# EAGLE design board (EAGLE 6.4)
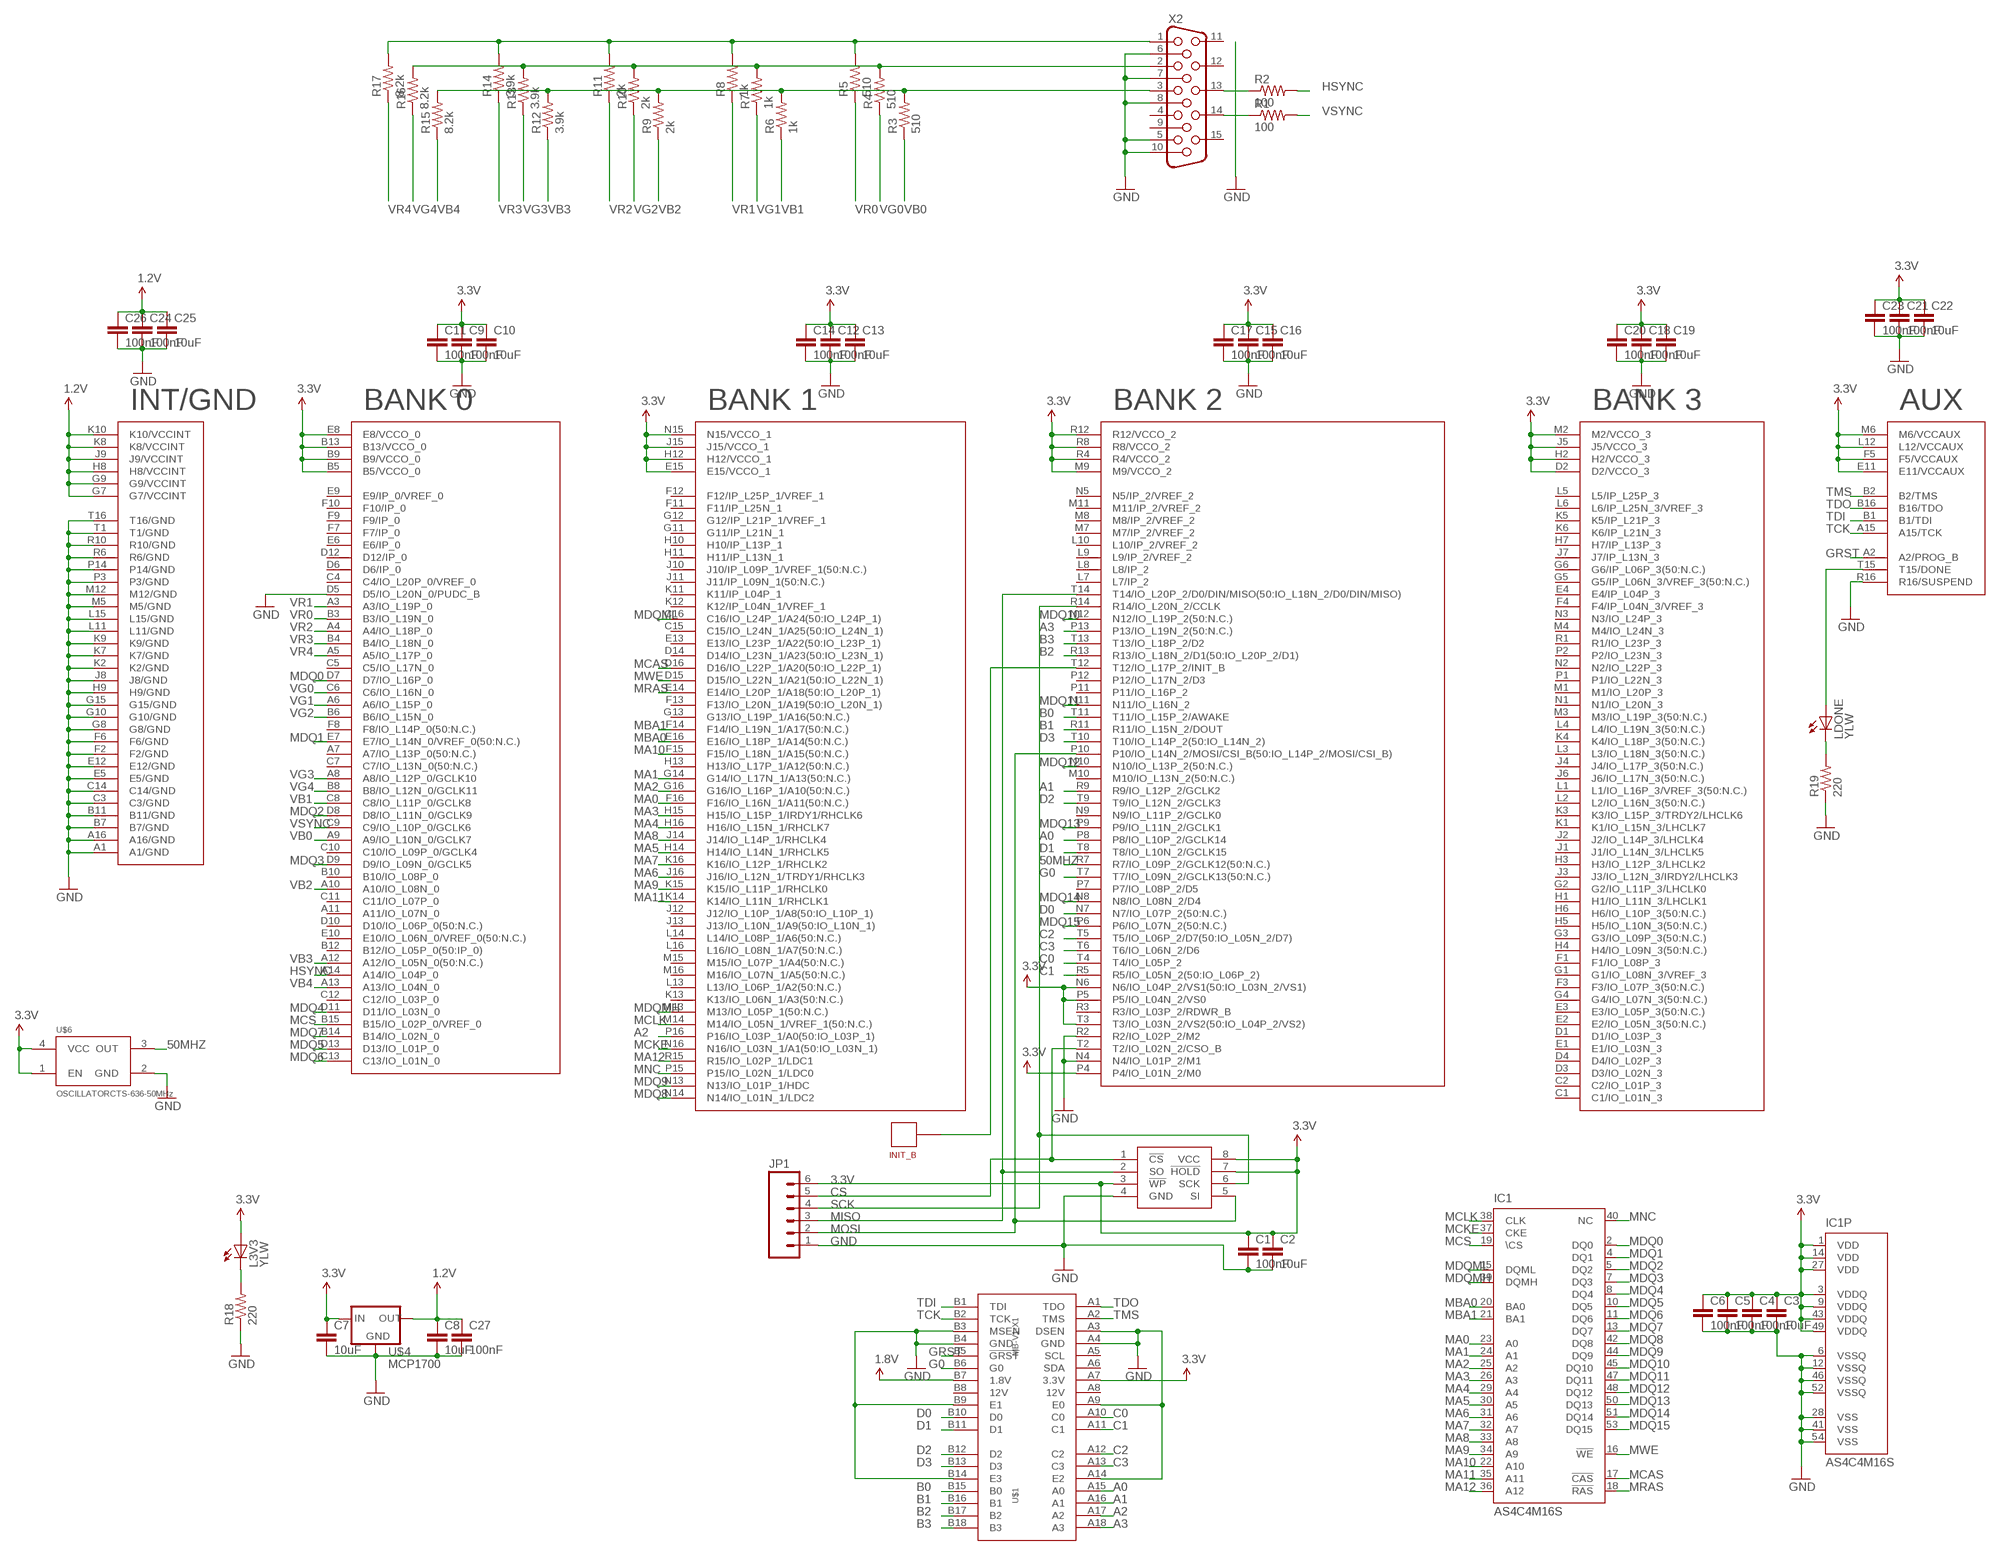
[diagram p0: schematic, sheet 1]

## Parts
C1  100nF  CAP0402-CAP  [0402-CAP]
C2  10uF  CAP0805  [0805]
C3  10uF  CAP0805  [0805]
C4  100nF  CAP0402-CAP  [0402-CAP]
C5  100nF  CAP0402-CAP  [0402-CAP]
C6  100nF  CAP0402-CAP  [0402-CAP]
C7  10uF  CAP0805  [0805]
C8  10uF  CAP0805  [0805]
C9  100nF  CAP0402-CAP  [0402-CAP]
C10  10uF  CAP0805  [0805]
C11  100nF  CAP0402-CAP  [0402-CAP]
C12  100nF  CAP0402-CAP  [0402-CAP]
C13  10uF  CAP0805  [0805]
C14  100nF  CAP0402-CAP  [0402-CAP]
C15  100nF  CAP0402-CAP  [0402-CAP]
C16  10uF  CAP0805  [0805]
C17  100nF  CAP0402-CAP  [0402-CAP]
C18  100nF  CAP0402-CAP  [0402-CAP]
C19  10uF  CAP0805  [0805]
C20  100nF  CAP0402-CAP  [0402-CAP]
C21  100nF  CAP0402-CAP  [0402-CAP]
C22  10uF  CAP0805  [0805]
C23  100nF  CAP0402-CAP  [0402-CAP]
C24  100nF  CAP0402-CAP  [0402-CAP]
C25  10uF  CAP0805  [0805]
C26  100nF  CAP0402-CAP  [0402-CAP]
C27  100nF  CAP0402-CAP  [0402-CAP]
IC1  AS4C4M16S  MT48LC64M4A2  [TSOP54-400]
INIT_B  CONNECTOR1.27  [TESTPAD-1.27]
JP1  M06SIP  [1X06]
L3V3  YLW  LED0603  [0603_LED]
LDONE  YLW  LED0603  [0603_LED]
R1  100  RESISTOR0603  [0603-RES]
R2  100  RESISTOR0603  [0603-RES]
R3  510  RESISTOR0603  [0603-RES]
R4  510  RESISTOR0603  [0603-RES]
R5  510  RESISTOR0603  [0603-RES]
R6  1k  RESISTOR0603  [0603-RES]
R7  1k  RESISTOR0603  [0603-RES]
R8  1k  RESISTOR0603  [0603-RES]
R9  2k  RESISTOR0603  [0603-RES]
R10  2k  RESISTOR0603  [0603-RES]
R11  2k  RESISTOR0603  [0603-RES]
R12  3.9k  RESISTOR0603  [0603-RES]
R13  3.9k  RESISTOR0603  [0603-RES]
R14  3.9k  RESISTOR0603  [0603-RES]
R15  8.2k  RESISTOR0603  [0603-RES]
R16  8.2k  RESISTOR0603  [0603-RES]
R17  8.2k  RESISTOR0603  [0603-RES]
R18  220  RESISTOR0603  [0603-RES]
R19  220  RESISTOR0603  [0603-RES]
U$1  MB-V1-X1  [PCIE-X1-EDGE]
U$2  XC3S{50,100,200}A-FT256  [XILINX_FT256]
U$4  MCP1700  VREGSOT23-3  [SOT23-3]
U$6  OSCILLATORCTS-636-50MHz  OSCILLATORCTS-636  [CTS-636]
U$7  S25FL  [SO08]
X2  HF15H  [HDF15H]

## Nets
1.2V: C8.1 C24.1 C25.1 C26.1 C27.1 U$2.G7(G7/VCCINT) U$2.G9(G9/VCCINT) U$2.H8(H8/VCCINT) U$2.J9(J9/VCCINT) U$2.K8(K8/VCCINT) U$2.K10(K10/VCCINT) U$4.2(OUT)
1.8V: U$1.B7(1.8V)
3.3V: C1.1 C2.1 C3.1 C4.1 C5.1 C6.1 C7.1 C9.1 C10.1 C11.1 C12.1 C13.1 C14.1 C15.1 C16.1 C17.1 C18.1 C19.1 C20.1 C21.1 C22.1 C23.1 IC1.1(VDD) IC1.3(VDDQ) IC1.9(VDDQ) IC1.14(VDD) IC1.27(VDD) IC1.43(VDDQ) IC1.49(VDDQ) JP1.6 L3V3.A U$1.A7(3.3V) U$2.B5(B5/VCCO_0) U$2.B9(B9/VCCO_0) U$2.B13(B13/VCCO_0) U$2.D2(D2/VCCO_3) U$2.E8(E8/VCCO_0) U$2.E11(E11/VCCAUX) U$2.E15(E15/VCCO_1) U$2.F5(F5/VCCAUX) U$2.H2(H2/VCCO_3) U$2.H12(H12/VCCO_1) U$2.J5(J5/VCCO_3) U$2.J15(J15/VCCO_1) U$2.L12(L12/VCCAUX) U$2.M2(M2/VCCO_3) U$2.M6(M6/VCCAUX) U$2.M9(M9/VCCO_2) U$2.N6(N6/IO_L04P_2/VS1(50:IO_L03N_2/VS1)) U$2.N15(N15/VCCO_1) U$2.P4(P4/IO_L01N_2/M0) U$2.P5(P5/IO_L04N_2/VS0) U$2.R4(R4/VCCO_2) U$2.R8(R8/VCCO_2) U$2.R12(R12/VCCO_2) U$2.T3(T3/IO_L03N_2/VS2(50:IO_L04P_2/VS2)) U$4.3(IN) U$6.1(EN) U$6.4(VCC) U$7.3(!WP) U$7.7(!HOLD) U$7.8(VCC)
50MHZ: U$2.R7(R7/IO_L09P_2/GCLK12(50:N.C.)) U$6.3(OUT)
A0: U$1.A15(A0) U$2.P8(P8/IO_L10P_2/GCLK14)
A1: U$1.A16(A1) U$2.R9(R9/IO_L12P_2/GCLK2)
A2: U$1.A17(A2) U$2.P16(P16/IO_L03P_1/A0(50:IO_L03P_1))
A3: U$1.A18(A3) U$2.P13(P13/IO_L19N_2(50:N.C.))
B0: U$1.B15(B0) U$2.T11(T11/IO_L15P_2/AWAKE)
B1: U$1.B16(B1) U$2.R11(R11/IO_L15N_2/DOUT)
B2: U$1.B17(B2) U$2.R13(R13/IO_L18N_2/D1(50:IO_L20P_2/D1))
B3: U$1.B18(B3) U$2.T13(T13/IO_L18P_2/D2)
C0: U$1.A10(C0) U$2.T4(T4/IO_L05P_2)
C1: U$1.A11(C1) U$2.R5(R5/IO_L05N_2(50:IO_L06P_2))
C2: U$1.A12(C2) U$2.T5(T5/IO_L06P_2/D7(50:IO_L05N_2/D7))
C3: U$1.A13(C3) U$2.T6(T6/IO_L06N_2/D6)
CS: JP1.5 U$2.T2(T2/IO_L02N_2/CSO_B) U$7.1(!CS)
D0: U$1.B10(D0) U$2.N7(N7/IO_L07P_2(50:N.C.))
D1: U$1.B11(D1) U$2.T8(T8/IO_L10N_2/GCLK15)
D2: U$1.B12(D2) U$2.T9(T9/IO_L12N_2/GCLK3)
D3: U$1.B13(D3) U$2.T10(T10/IO_L14P_2(50:IO_L14N_2))
DONE: LDONE.A U$2.T15(T15/DONE)
G0: U$1.B6(G0) U$2.T7(T7/IO_L09N_2/GCLK13(50:N.C.))
GND: C1.2 C2.2 C3.2 C4.2 C5.2 C6.2 C7.2 C8.2 C9.2 C10.2 C11.2 C12.2 C13.2 C14.2 C15.2 C16.2 C17.2 C18.2 C19.2 C20.2 C21.2 C22.2 C23.2 C24.2 C25.2 C26.2 C27.2 IC1.6(VSSQ) IC1.12(VSSQ) IC1.28(VSS) IC1.41(VSS) IC1.46(VSSQ) IC1.52(VSSQ) IC1.54(VSS) JP1.1 R18.1 R19.1 U$1.A3(DSEN) U$1.A4(GND) U$1.A9(E0) U$1.A14(E2) U$1.B3(MSEN) U$1.B4(GND) U$1.B9(E1) U$1.B14(E3) U$2.A1(A1/GND) U$2.A16(A16/GND) U$2.B7(B7/GND) U$2.B11(B11/GND) U$2.C3(C3/GND) U$2.C14(C14/GND) U$2.D5(D5/IO_L20N_0/PUDC_B) U$2.E5(E5/GND) U$2.E12(E12/GND) U$2.F2(F2/GND) U$2.F6(F6/GND) U$2.G8(G8/GND) U$2.G10(G10/GND) U$2.G15(G15/GND) U$2.H9(H9/GND) U$2.J8(J8/GND) U$2.K2(K2/GND) U$2.K7(K7/GND) U$2.K9(K9/GND) U$2.L11(L11/GND) U$2.L15(L15/GND) U$2.M5(M5/GND) U$2.M12(M12/GND) U$2.N4(N4/IO_L01P_2/M1) U$2.P3(P3/GND) U$2.P14(P14/GND) U$2.R2(R2/IO_L02P_2/M2) U$2.R6(R6/GND) U$2.R10(R10/GND) U$2.R16(R16/SUSPEND) U$2.T1(T1/GND) U$2.T16(T16/GND) U$4.1(GND) U$6.2(GND) U$7.4(GND) X2.5 X2.6 X2.7 X2.8 X2.10
GRST: U$1.B5(!GRST) U$2.A2(A2/PROG_B)
HSYNC: R2.2 U$2.A14(A14/IO_L04P_0)
MA0: IC1.23(A0) U$2.F16(F16/IO_L16N_1/A11(50:N.C.))
MA1: IC1.24(A1) U$2.G14(G14/IO_L17N_1/A13(50:N.C.))
MA2: IC1.25(A2) U$2.G16(G16/IO_L16P_1/A10(50:N.C.))
MA3: IC1.26(A3) U$2.H15(H15/IO_L15P_1/IRDY1/RHCLK6)
MA4: IC1.29(A4) U$2.H16(H16/IO_L15N_1/RHCLK7)
MA5: IC1.30(A5) U$2.H14(H14/IO_L14N_1/RHCLK5)
MA6: IC1.31(A6) U$2.J16(J16/IO_L12N_1/TRDY1/RHCLK3)
MA7: IC1.32(A7) U$2.K16(K16/IO_L12P_1/RHCLK2)
MA8: IC1.33(A8) U$2.J14(J14/IO_L14P_1/RHCLK4)
MA9: IC1.34(A9) U$2.K15(K15/IO_L11P_1/RHCLK0)
MA10: IC1.22(A10) U$2.F15(F15/IO_L18N_1/A15(50:N.C.))
MA11: IC1.35(A11) U$2.K14(K14/IO_L11N_1/RHCLK1)
MA12: IC1.36(A12) U$2.R15(R15/IO_L02P_1/LDC1)
MBA0: IC1.20(BA0) U$2.E16(E16/IO_L18P_1/A14(50:N.C.))
MBA1: IC1.21(BA1) U$2.F14(F14/IO_L19N_1/A17(50:N.C.))
MCAS: IC1.17(!CAS) U$2.D16(D16/IO_L22P_1/A20(50:IO_L22P_1))
MCKE: IC1.37(CKE) U$2.N16(N16/IO_L03N_1/A1(50:IO_L03N_1))
MCLK: IC1.38(CLK) U$2.M14(M14/IO_L05N_1/VREF_1(50:N.C.))
MCS: IC1.19(\CS) U$2.B15(B15/IO_L02P_0/VREF_0)
MDQ0: IC1.2(DQ0) U$2.D7(D7/IO_L16P_0)
MDQ1: IC1.4(DQ1) U$2.E7(E7/IO_L14N_0/VREF_0(50:N.C.))
MDQ2: IC1.5(DQ2) U$2.D8(D8/IO_L11N_0/GCLK9)
MDQ3: IC1.7(DQ3) U$2.D9(D9/IO_L09N_0/GCLK5)
MDQ4: IC1.8(DQ4) U$2.D11(D11/IO_L03N_0)
MDQ5: IC1.10(DQ5) U$2.D13(D13/IO_L01P_0)
MDQ6: IC1.11(DQ6) U$2.C13(C13/IO_L01N_0)
MDQ7: IC1.13(DQ7) U$2.B14(B14/IO_L02N_0)
MDQ8: IC1.42(DQ8) U$2.N14(N14/IO_L01N_1/LDC2)
MDQ9: IC1.44(DQ9) U$2.N13(N13/IO_L01P_1/HDC)
MDQ10: IC1.45(DQ10) U$2.N12(N12/IO_L19P_2(50:N.C.))
MDQ11: IC1.47(DQ11) U$2.N11(N11/IO_L16N_2)
MDQ12: IC1.48(DQ12) U$2.N10(N10/IO_L13P_2(50:N.C.))
MDQ13: IC1.50(DQ13) U$2.P9(P9/IO_L11N_2/GCLK1)
MDQ14: IC1.51(DQ14) U$2.N8(N8/IO_L08N_2/D4)
MDQ15: IC1.53(DQ15) U$2.P6(P6/IO_L07N_2(50:N.C.))
MDQMH: IC1.39(DQMH) U$2.M13(M13/IO_L05P_1(50:N.C.))
MDQML: IC1.15(DQML) U$2.C16(C16/IO_L24P_1/A24(50:IO_L24P_1))
MISO: JP1.3 U$2.T14(T14/IO_L20P_2/D0/DIN/MISO(50:IO_L18N_2/D0/DIN/MISO)) U$7.2(SO)
MNC: IC1.40(NC) U$2.P15(P15/IO_L02N_1/LDC0)
MOSI: JP1.2 U$2.P10(P10/IO_L14N_2/MOSI/CSI_B(50:IO_L14P_2/MOSI/CSI_B)) U$7.5(SI)
MRAS: IC1.18(!RAS) U$2.E14(E14/IO_L20P_1/A18(50:IO_L20P_1))
MWE: IC1.16(!WE) U$2.D15(D15/IO_L22N_1/A21(50:IO_L22N_1))
N$1: R1.1 X2.14
N$2: R2.1 X2.13
N$3: LDONE.C R19.2
N$4: INIT_B.P U$2.T12(T12/IO_L17P_2/INIT_B)
N$5: R3.2 R6.2 R9.2 R12.2 R15.2 X2.3
N$6: L3V3.C R18.2
N$7: R4.2 R7.2 R10.2 R13.2 R16.2 X2.2
N$8: R5.2 R8.2 R11.2 R14.2 R17.2 X2.1
SCK: JP1.4 U$2.R14(R14/IO_L20N_2/CCLK) U$7.6(SCK)
TCK: U$1.B2(TCK) U$2.A15(A15/TCK)
TDI: U$1.B1(TDI) U$2.B1(B1/TDI)
TDO: U$1.A1(TDO) U$2.B16(B16/TDO)
TMS: U$1.A2(TMS) U$2.B2(B2/TMS)
VB0: R3.1 U$2.A9(A9/IO_L10N_0/GCLK7)
VB1: R6.1 U$2.C8(C8/IO_L11P_0/GCLK8)
VB2: R9.1 U$2.A10(A10/IO_L08N_0)
VB3: R12.1 U$2.A12(A12/IO_L05N_0(50:N.C.))
VB4: R15.1 U$2.A13(A13/IO_L04N_0)
VG0: R4.1 U$2.C6(C6/IO_L16N_0)
VG1: R7.1 U$2.A6(A6/IO_L15P_0)
VG2: R10.1 U$2.B6(B6/IO_L15N_0)
VG3: R13.1 U$2.A8(A8/IO_L12P_0/GCLK10)
VG4: R16.1 U$2.B8(B8/IO_L12N_0/GCLK11)
VR0: R5.1 U$2.B3(B3/IO_L19N_0)
VR1: R8.1 U$2.A3(A3/IO_L19P_0)
VR2: R11.1 U$2.A4(A4/IO_L18P_0)
VR3: R14.1 U$2.B4(B4/IO_L18N_0)
VR4: R17.1 U$2.A5(A5/IO_L17P_0)
VSYNC: R1.2 U$2.C9(C9/IO_L10P_0/GCLK6)
Unconnected: U$1.A5(SCL) U$1.A6(SDA) U$1.A8(12V) U$1.B8(12V) U$2.A7(A7/IO_L13P_0(50:N.C.)) U$2.A11(A11/IO_L07N_0) U$2.B10(B10/IO_L08P_0) U$2.B12(B12/IO_L05P_0(50:IP_0)) U$2.C1(C1/IO_L01N_3) U$2.C2(C2/IO_L01P_3) U$2.C4(C4/IO_L20P_0/VREF_0) U$2.C5(C5/IO_L17N_0) U$2.C7(C7/IO_L13N_0(50:N.C.)) U$2.C10(C10/IO_L09P_0/GCLK4) U$2.C11(C11/IO_L07P_0) U$2.C12(C12/IO_L03P_0) U$2.C15(C15/IO_L24N_1/A25(50:IO_L24N_1)) U$2.D1(D1/IO_L03P_3) U$2.D3(D3/IO_L02N_3) U$2.D4(D4/IO_L02P_3) U$2.D6(D6/IP_0) U$2.D10(D10/IO_L06P_0(50:N.C.)) U$2.D12(D12/IP_0) U$2.D14(D14/IO_L23N_1/A23(50:IO_L23N_1)) U$2.E1(E1/IO_L03N_3) U$2.E2(E2/IO_L05N_3(50:N.C.)) U$2.E3(E3/IO_L05P_3(50:N.C.)) U$2.E4(E4/IP_L04P_3) U$2.E6(E6/IP_0) U$2.E9(E9/IP_0/VREF_0) U$2.E10(E10/IO_L06N_0/VREF_0(50:N.C.)) U$2.E13(E13/IO_L23P_1/A22(50:IO_L23P_1)) U$2.F1(F1/IO_L08P_3) U$2.F3(F3/IO_L07P_3(50:N.C.)) U$2.F4(F4/IP_L04N_3/VREF_3) U$2.F7(F7/IP_0) U$2.F8(F8/IO_L14P_0(50:N.C.)) U$2.F9(F9/IP_0) U$2.F10(F10/IP_0) U$2.F11(F11/IP_L25N_1) U$2.F12(F12/IP_L25P_1/VREF_1) U$2.F13(F13/IO_L20N_1/A19(50:IO_L20N_1)) U$2.G1(G1/IO_L08N_3/VREF_3) U$2.G2(G2/IO_L11P_3/LHCLK0) U$2.G3(G3/IO_L09P_3(50:N.C.)) U$2.G4(G4/IO_L07N_3(50:N.C.)) U$2.G5(G5/IP_L06N_3/VREF_3(50:N.C.)) U$2.G6(G6/IP_L06P_3(50:N.C.)) U$2.G11(G11/IP_L21N_1) U$2.G12(G12/IP_L21P_1/VREF_1) U$2.G13(G13/IO_L19P_1/A16(50:N.C.)) U$2.H1(H1/IO_L11N_3/LHCLK1) U$2.H3(H3/IO_L12P_3/LHCLK2) U$2.H4(H4/IO_L09N_3(50:N.C.)) U$2.H5(H5/IO_L10N_3(50:N.C.)) U$2.H6(H6/IO_L10P_3(50:N.C.)) U$2.H7(H7/IP_L13P_3) U$2.H10(H10/IP_L13P_1) U$2.H11(H11/IP_L13N_1) U$2.H13(H13/IO_L17P_1/A12(50:N.C.)) U$2.J1(J1/IO_L14N_3/LHCLK5) U$2.J2(J2/IO_L14P_3/LHCLK4) U$2.J3(J3/IO_L12N_3/IRDY2/LHCLK3) U$2.J4(J4/IO_L17P_3(50:N.C.)) U$2.J6(J6/IO_L17N_3(50:N.C.)) U$2.J7(J7/IP_L13N_3) U$2.J10(J10/IP_L09P_1/VREF_1(50:N.C.)) U$2.J11(J11/IP_L09N_1(50:N.C.)) U$2.J12(J12/IO_L10P_1/A8(50:IO_L10P_1)) U$2.J13(J13/IO_L10N_1/A9(50:IO_L10N_1)) U$2.K1(K1/IO_L15N_3/LHCLK7) U$2.K3(K3/IO_L15P_3/TRDY2/LHCLK6) U$2.K4(K4/IO_L18P_3(50:N.C.)) U$2.K5(K5/IP_L21P_3) U$2.K6(K6/IP_L21N_3) U$2.K11(K11/IP_L04P_1) U$2.K12(K12/IP_L04N_1/VREF_1) U$2.K13(K13/IO_L06N_1/A3(50:N.C.)) U$2.L1(L1/IO_L16P_3/VREF_3(50:N.C.)) U$2.L2(L2/IO_L16N_3(50:N.C.)) U$2.L3(L3/IO_L18N_3(50:N.C.)) U$2.L4(L4/IO_L19N_3(50:N.C.)) U$2.L5(L5/IP_L25P_3) U$2.L6(L6/IP_L25N_3/VREF_3) U$2.L7(L7/IP_2) U$2.L8(L8/IP_2) U$2.L9(L9/IP_2/VREF_2) U$2.L10(L10/IP_2/VREF_2) U$2.L13(L13/IO_L06P_1/A2(50:N.C.)) U$2.L14(L14/IO_L08P_1/A6(50:N.C.)) U$2.L16(L16/IO_L08N_1/A7(50:N.C.)) U$2.M1(M1/IO_L20P_3) U$2.M3(M3/IO_L19P_3(50:N.C.)) U$2.M4(M4/IO_L24N_3) U$2.M7(M7/IP_2/VREF_2) U$2.M8(M8/IP_2/VREF_2) U$2.M10(M10/IO_L13N_2(50:N.C.)) U$2.M11(M11/IP_2/VREF_2) U$2.M15(M15/IO_L07P_1/A4(50:N.C.)) U$2.M16(M16/IO_L07N_1/A5(50:N.C.)) U$2.N1(N1/IO_L20N_3) U$2.N2(N2/IO_L22P_3) U$2.N3(N3/IO_L24P_3) U$2.N5(N5/IP_2/VREF_2) U$2.N9(N9/IO_L11P_2/GCLK0) U$2.P1(P1/IO_L22N_3) U$2.P2(P2/IO_L23N_3) U$2.P7(P7/IO_L08P_2/D5) U$2.P11(P11/IO_L16P_2) U$2.P12(P12/IO_L17N_2/D3) U$2.R1(R1/IO_L23P_3) U$2.R3(R3/IO_L03P_2/RDWR_B) X2.4 X2.9 X2.11 X2.12 X2.15

## Library data of the parts
C1-C27 = kmod-passives:CAP: Capacitor Standard 0603 ceramic capacitor, and 0.1" leaded capacitor.
IC1 = memory-micron:MT48LC64M4A2: 256Mb: x16 SDRAM MT48LC64M4A2 - 16 Meg x 4 x 4 banks Source: http://download.micron.com/pdf/datasheets/dram/sdram/256MSDRAM.pdf; OC_FARNELL: unknown; OC_NEWARK: unknown
INIT_B = kmod-nonparts:CONNECTOR: Collection of holes/pads for testing/connecting
JP1 = SparkFun-Connectors:M06: Header 6 Standard 6-pin 0.1" header. Use with straight break away headers (SKU : PRT-00116), right angle break away headers (PRT-00553), swiss pins (PRT-00743), machine pins (PRT-00117), and female headers (PRT-00115). Molex polarized connector foot print use with SKU : PRT-08094 with associated crimp pins and housings. NOTES ON THE VARIANTS LOCK and LOCK_LONGPADS... This footprint was designed to help hold the alignment of a through-hole component (i.e. 6-pin header) while soldering it into place. You may notice that each hole has been shifted either up or down by 0.005 of an inch from it's more standard position (which is a perfectly straight line). This slight alteration caused the pins (the squares in the middle) to touch the edges of the holes. Because they are alternating, it causes a "brace" to hold the component in place. 0.005 has proven to be the perfect amount of "off-center" position when using our standard breakaway headers. Although looks a little odd when you look at the bare footprint, once you have a header in there, the alteration is very hard to notice. Also,if you push a header all the way into place, it is covered up entirely on the bottom side. This idea of altering the position of holes to aid alignment will be further integrated into the Sparkfun Library for other footprints. It can help hold any component with 3 or more connection pins.
L3V3 LDONE = kmod-passives:LED
R1-R19 = kmod-passives:RESISTOR: Resistor Basic schematic elements and footprints for 0603, 1206, and PTH resistors.
U$1 = kmod-connectors:MB-V1-X1
U$2 = kmod-xilinx:XC3S{50,100,200}A-FT256
U$4 = kmod-ics:VREG
U$6 = kmod-mechanical:OSCILLATOR
U$7 = kmod-ics:S25FL: Spansion S25FL* SPI flash
X2 = con-subd:HF15: SUB-D; OC_FARNELL: unknown; OC_NEWARK: unknown

## Board
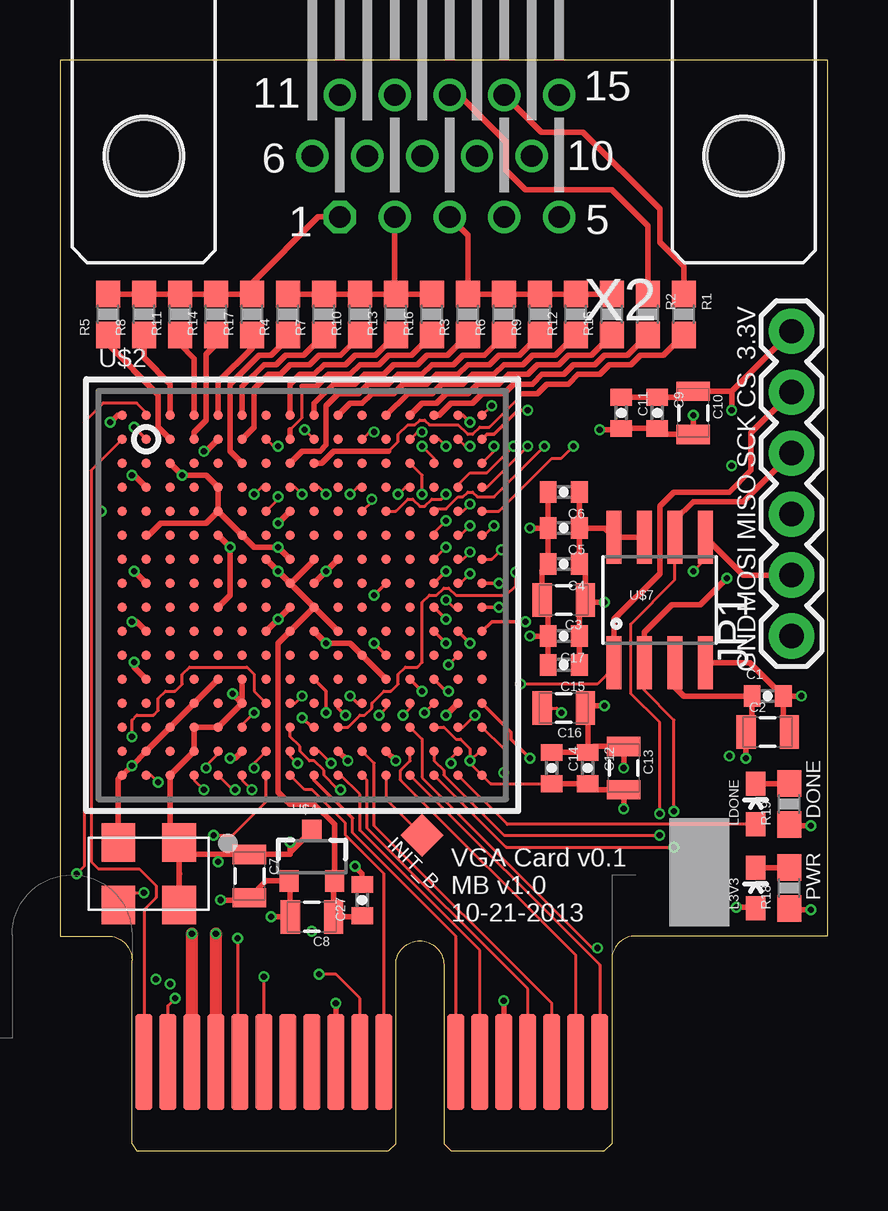
[diagram p1: board, top side]
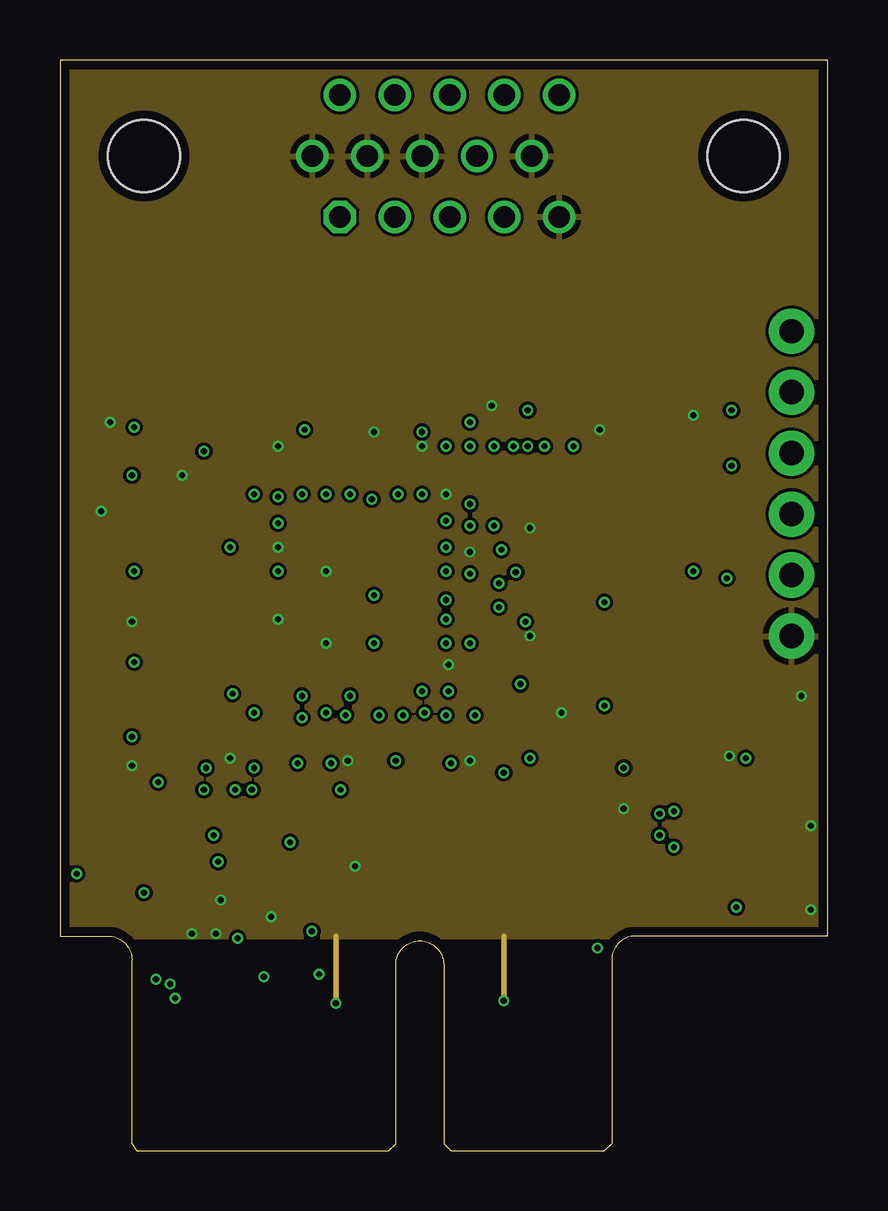
[diagram p2: board, inner layer Route2]
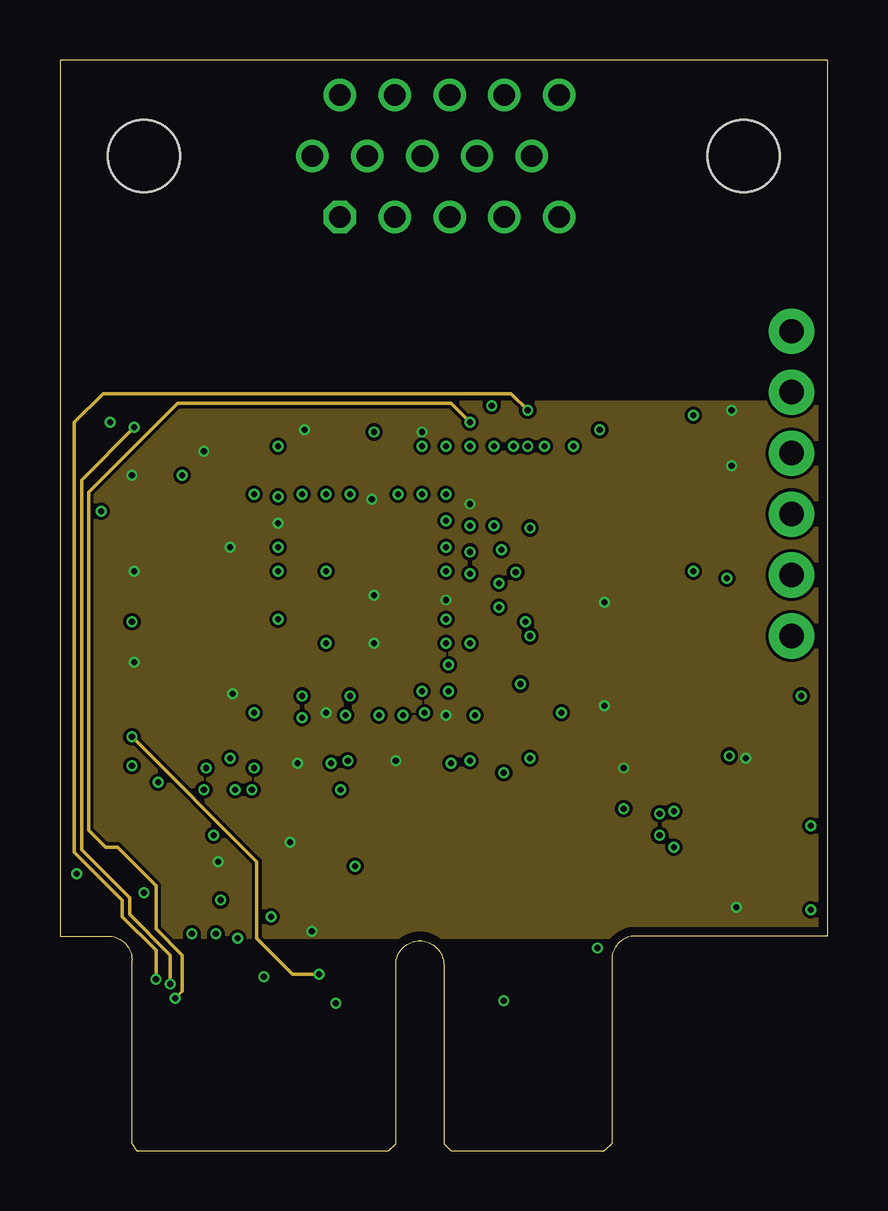
[diagram p3: board, inner layer Route15]
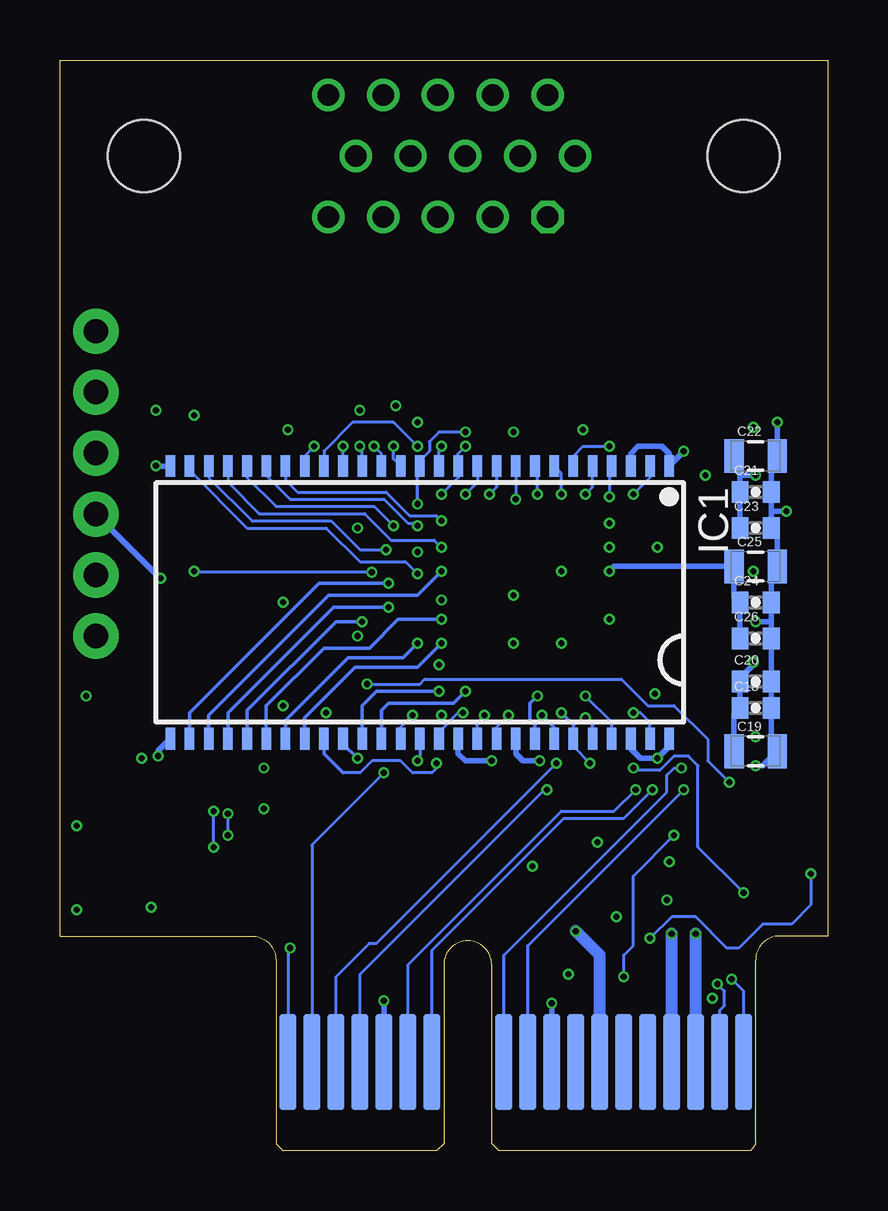
[diagram p4: board, bottom side, seen from below]

Size 32 x 45.45 mm. Coordinates in mm from the lower left corner, seen from the top.
Outline: 3,7.95 arc90 2,8.95 0,8.95 0,45.45 32,45.45 32,8.95 24,8.95 arc90 23,7.95
Copper layers (1+2*15+16): Top 0.0356mm / dielectric 0.17mm / Route2 0.0178mm / dielectric 1.1941mm / Route15 0.0178mm / dielectric 0.17mm / Bottom 0.0356mm
Design rules "OSHPark_mine_4layer *": minimum track width 5mil, minimum drill 10mil, track to track 5mil, track to pad 5mil, pad to pad 5mil, via to via 5mil, smd to smd 5mil, copper to edge 15mil, drill to drill 6mil, minimum pad ring 4mil, minimum via ring 4mil, stop-mask expansion 2mil, vias tented up to drill 13mil, thermal gap 10mil

### Footprints (pad centres in the part's own frame; a part is rotated, then mirrored left to right if it is on the bottom)
0402-CAP = smd 0.7 x 0.9: 1 -0.65,0; 2 0.65,0
0805 = smd 0.8 x 1.4: 1 -0.9,0; 2 0.9,0
TSOP54-400 = smd 0.4 x 0.9: 1 -10.4,-5.68; 2 -9.6,-5.68; 3 -8.8,-5.68; 4 -8,-5.68; 5 -7.2,-5.68; 6 -6.4,-5.68; 7 -5.6,-5.68; 8 -4.8,-5.68; 9 -4,-5.68; 10 -3.2,-5.68; 11 -2.4,-5.68; 12 -1.6,-5.68; 13 -0.8,-5.68; 14 0,-5.68; 15 0.8,-5.68; 16 1.6,-5.68; 17 2.4,-5.68; 18 3.2,-5.68; 19 4,-5.68; 20 4.8,-5.68; 21 5.6,-5.68; 22 6.4,-5.68; 23 7.2,-5.68; 24 8,-5.68; 25 8.8,-5.68; 26 9.6,-5.68; 27 10.4,-5.68; 28 10.4,5.68; 29 9.6,5.68; 30 8.8,5.68; 31 8,5.68; 32 7.2,5.68; 33 6.4,5.68; 34 5.6,5.68; 35 4.8,5.68; 36 4,5.68; 37 3.2,5.68; 38 2.4,5.68; 39 1.6,5.68; 40 0.8,5.68; 41 0,5.68; 42 -0.8,5.68; 43 -1.6,5.68; 44 -2.4,5.68; 45 -3.2,5.68; 46 -4,5.68; 47 -4.8,5.68; 48 -5.6,5.68; 49 -6.4,5.68; 50 -7.2,5.68; 51 -8,5.68; 52 -8.8,5.68; 53 -9.6,5.68; 54 -10.4,5.68
TESTPAD-1.27 = smd 1.27 x 1.27: P 0,0
1X06 = drill 1.016 pad 1.88: 1 0,0; 2 2.54,0; 3 5.08,0; 4 7.62,0; 5 10.16,0; 6 12.7,0
0603_LED = smd 0.8 x 1.003: A 0,-0.852; C 0,0.852
0603-RES = smd 1.1 x 1: 1 -0.85,0; 2 0.85,0
PCIE-X1-EDGE = smd 0.7 x 4 bottom: A1 -11.5,-0.75; A2 -10.5,-0.75; A3 -9.5,-0.75; A4 -8.5,-0.75; A5 -7.5,-0.75; A6 -6.5,-0.75; A7 -5.5,-0.75; A8 -4.5,-0.75; A9 -3.5,-0.75; A10 -2.5,-0.75; A11 -1.5,-0.75; A12 1.5,-0.75; A13 2.5,-0.75; A14 3.5,-0.75; A15 4.5,-0.75; A16 5.5,-0.75; A17 6.5,-0.75; A18 7.5,-0.75 | smd 0.7 x 4: B1 -11.5,-0.75; B2 -10.5,-0.75; B3 -9.5,-0.75; B4 -8.5,-0.75; B5 -7.5,-0.75; B6 -6.5,-0.75; B7 -5.5,-0.75; B8 -4.5,-0.75; B9 -3.5,-0.75; B10 -2.5,-0.75; B11 -1.5,-0.75; B12 1.5,-0.75; B13 2.5,-0.75; B14 3.5,-0.75; B15 4.5,-0.75; B16 5.5,-0.75; B17 6.5,-0.75; B18 7.5,-0.75
XILINX_FT256 = smd 0.4 x 0.4: A1 -7.5,7.5; A2 -6.5,7.5; A3 -5.5,7.5; A4 -4.5,7.5; A5 -3.5,7.5; A6 -2.5,7.5; A7 -1.5,7.5; A8 -0.5,7.5; A9 0.5,7.5; A10 1.5,7.5; A11 2.5,7.5; A12 3.5,7.5; A13 4.5,7.5; A14 5.5,7.5; A15 6.5,7.5; A16 7.5,7.5; B1 -7.5,6.5; B2 -6.5,6.5; B3 -5.5,6.5; B4 -4.5,6.5; B5 -3.5,6.5; B6 -2.5,6.5; B7 -1.5,6.5; B8 -0.5,6.5; B9 0.5,6.5; B10 1.5,6.5; B11 2.5,6.5; B12 3.5,6.5; B13 4.5,6.5; B14 5.5,6.5; B15 6.5,6.5; B16 7.5,6.5; C1 -7.5,5.5; C2 -6.5,5.5; C3 -5.5,5.5; C4 -4.5,5.5; C5 -3.5,5.5; C6 -2.5,5.5; C7 -1.5,5.5; C8 -0.5,5.5; C9 0.5,5.5; C10 1.5,5.5; C11 2.5,5.5; C12 3.5,5.5; C13 4.5,5.5; C14 5.5,5.5; C15 6.5,5.5; C16 7.5,5.5; D1 -7.5,4.5; D2 -6.5,4.5; D3 -5.5,4.5; D4 -4.5,4.5; D5 -3.5,4.5; D6 -2.5,4.5; D7 -1.5,4.5; D8 -0.5,4.5; D9 0.5,4.5; D10 1.5,4.5; D11 2.5,4.5; D12 3.5,4.5; D13 4.5,4.5; D14 5.5,4.5; D15 6.5,4.5; D16 7.5,4.5; E1 -7.5,3.5; E2 -6.5,3.5; E3 -5.5,3.5; E4 -4.5,3.5; E5 -3.5,3.5; E6 -2.5,3.5; E7 -1.5,3.5; E8 -0.5,3.5; E9 0.5,3.5; E10 1.5,3.5; E11 2.5,3.5; E12 3.5,3.5; E13 4.5,3.5; E14 5.5,3.5; E15 6.5,3.5; E16 7.5,3.5; F1 -7.5,2.5; F2 -6.5,2.5; F3 -5.5,2.5; F4 -4.5,2.5; F5 -3.5,2.5; F6 -2.5,2.5; F7 -1.5,2.5; F8 -0.5,2.5; F9 0.5,2.5; F10 1.5,2.5; F11 2.5,2.5; F12 3.5,2.5; F13 4.5,2.5; F14 5.5,2.5; F15 6.5,2.5; F16 7.5,2.5; G1 -7.5,1.5; G2 -6.5,1.5; G3 -5.5,1.5; G4 -4.5,1.5; G5 -3.5,1.5; G6 -2.5,1.5; G7 -1.5,1.5; G8 -0.5,1.5; G9 0.5,1.5; G10 1.5,1.5; G11 2.5,1.5; G12 3.5,1.5; G13 4.5,1.5; G14 5.5,1.5; G15 6.5,1.5; G16 7.5,1.5; H1 -7.5,0.5; H2 -6.5,0.5; H3 -5.5,0.5; H4 -4.5,0.5; H5 -3.5,0.5; H6 -2.5,0.5; H7 -1.5,0.5; H8 -0.5,0.5; H9 0.5,0.5; H10 1.5,0.5; H11 2.5,0.5; H12 3.5,0.5; H13 4.5,0.5; H14 5.5,0.5; H15 6.5,0.5; H16 7.5,0.5; J1 -7.5,-0.5; J2 -6.5,-0.5; J3 -5.5,-0.5; J4 -4.5,-0.5; J5 -3.5,-0.5; J6 -2.5,-0.5; J7 -1.5,-0.5; J8 -0.5,-0.5; J9 0.5,-0.5; J10 1.5,-0.5; J11 2.5,-0.5; J12 3.5,-0.5; J13 4.5,-0.5; J14 5.5,-0.5; J15 6.5,-0.5; J16 7.5,-0.5; K1 -7.5,-1.5; K2 -6.5,-1.5; K3 -5.5,-1.5; K4 -4.5,-1.5; K5 -3.5,-1.5; K6 -2.5,-1.5; K7 -1.5,-1.5; K8 -0.5,-1.5; K9 0.5,-1.5; K10 1.5,-1.5; K11 2.5,-1.5; K12 3.5,-1.5; K13 4.5,-1.5; K14 5.5,-1.5; K15 6.5,-1.5; K16 7.5,-1.5; L1 -7.5,-2.5; L2 -6.5,-2.5; L3 -5.5,-2.5; L4 -4.5,-2.5; L5 -3.5,-2.5; L6 -2.5,-2.5; L7 -1.5,-2.5; L8 -0.5,-2.5; L9 0.5,-2.5; L10 1.5,-2.5; L11 2.5,-2.5; L12 3.5,-2.5; L13 4.5,-2.5; L14 5.5,-2.5; L15 6.5,-2.5; L16 7.5,-2.5; M1 -7.5,-3.5; M2 -6.5,-3.5; M3 -5.5,-3.5; M4 -4.5,-3.5; M5 -3.5,-3.5; M6 -2.5,-3.5; M7 -1.5,-3.5; M8 -0.5,-3.5; M9 0.5,-3.5; M10 1.5,-3.5; M11 2.5,-3.5; M12 3.5,-3.5; M13 4.5,-3.5; M14 5.5,-3.5; M15 6.5,-3.5; M16 7.5,-3.5; N1 -7.5,-4.5; N2 -6.5,-4.5; N3 -5.5,-4.5; N4 -4.5,-4.5; N5 -3.5,-4.5; N6 -2.5,-4.5; N7 -1.5,-4.5; N8 -0.5,-4.5; N9 0.5,-4.5; N10 1.5,-4.5; N11 2.5,-4.5; N12 3.5,-4.5; N13 4.5,-4.5; N14 5.5,-4.5; N15 6.5,-4.5; N16 7.5,-4.5; P1 -7.5,-5.5; P2 -6.5,-5.5; P3 -5.5,-5.5; P4 -4.5,-5.5; P5 -3.5,-5.5; P6 -2.5,-5.5; P7 -1.5,-5.5; P8 -0.5,-5.5; P9 0.5,-5.5; P10 1.5,-5.5; P11 2.5,-5.5; P12 3.5,-5.5; P13 4.5,-5.5; P14 5.5,-5.5; P15 6.5,-5.5; P16 7.5,-5.5; R1 -7.5,-6.5; R2 -6.5,-6.5; R3 -5.5,-6.5; R4 -4.5,-6.5; R5 -3.5,-6.5; R6 -2.5,-6.5; R7 -1.5,-6.5; R8 -0.5,-6.5; R9 0.5,-6.5; R10 1.5,-6.5; R11 2.5,-6.5; R12 3.5,-6.5; R13 4.5,-6.5; R14 5.5,-6.5; R15 6.5,-6.5; R16 7.5,-6.5; T1 -7.5,-7.5; T2 -6.5,-7.5; T3 -5.5,-7.5; T4 -4.5,-7.5; T5 -3.5,-7.5; T6 -2.5,-7.5; T7 -1.5,-7.5; T8 -0.5,-7.5; T9 0.5,-7.5; T10 1.5,-7.5; T11 2.5,-7.5; T12 3.5,-7.5; T13 4.5,-7.5; T14 5.5,-7.5; T15 6.5,-7.5; T16 7.5,-7.5
SOT23-3 = smd 0.8 x 0.9: 1 -0.95,-1; 2 0.95,-1; 3 0,1.1
CTS-636 = smd 1.4 x 1.6: 1 -1.27,-1.3; 2 1.27,-1.3; 3 1.27,1.3; 4 -1.27,1.3
SO08 = smd 0.61 x 2.21: 1 -1.905,-2.616; 2 -0.635,-2.616; 3 0.635,-2.616; 4 1.905,-2.616; 5 1.905,2.616; 6 0.635,2.616; 7 -0.635,2.616; 8 -1.905,2.616
HDF15H = drill 0.9 octagon: 1 4.329,2.54 | drill 0.9: 2 2.043,2.54; 3 -0.243,2.54; 4 -2.529,2.54; 5 -4.815,2.54; 6 5.472,0; 7 3.186,0; 8 0.9,0; 9 -1.386,0; 10 -3.672,0; 11 4.329,-2.54; 12 2.043,-2.54; 13 -0.243,-2.54; 14 -2.529,-2.54; 15 -4.815,-2.54 | hole 3: -12.5,0; 12.5,0

### Placement (x,y rotation side)
C1  29.5,18.95 0 top
C2  29.5,17.45 0 top
C3  21,22.95 180 top
C4  21,24.45 180 top
C5  21,25.95 180 top
C6  21,27.45 180 top
C7  7.9,11.45 270 top
C8  10.5,9.75 180 top
C9  24.9,30.75 270 top
C10  26.4,30.75 270 top
C11  23.4,30.75 270 top
C12  22,15.95 270 top
C13  23.5,15.95 270 top
C14  20.5,15.95 270 top
C15  21,20.25 180 top
C16  21,18.45 180 top
C17  21,21.45 180 top
C18  3,18.45 0 bottom
C19  3,16.65 0 bottom
C20  3,19.55 0 bottom
C21  3,27.45 0 bottom
C22  3,28.95 0 bottom
C23  3,25.95 0 bottom
C24  3,22.85 0 bottom
C25  3,24.35 0 bottom
C26  3,21.35 0 bottom
C27  12.6,10.45 90 top
IC1  17,22.85 180 bottom
INIT_B  15.1,13.15 315 top
JP1  30.5,21.45 90 top
L3V3  29,10.95 0 top
LDONE  29,14.45 0 top
R1  26,34.85 270 top
R2  24.5,34.85 270 top
R3  17,34.85 90 top
R4  9.5,34.85 90 top
R5  2,34.85 90 top
R6  18.5,34.85 90 top
R7  11,34.85 90 top
R8  3.5,34.85 90 top
R9  20,34.85 90 top
R10  12.5,34.85 90 top
R11  5,34.85 90 top
R12  21.5,34.85 90 top
R13  14,34.85 90 top
R14  6.5,34.85 90 top
R15  23,34.85 90 top
R16  15.5,34.85 90 top
R17  8,34.85 90 top
R18  30.4,10.95 90 top
R19  30.4,14.45 90 top
U$1  15,4.45 0 top
U$2  10.1,23.15 0 top
U$4  10.5,12.25 0 top
U$6  3.7,11.55 180 top
U$7  25,22.95 0 top
X2  16,41.45 180 top

### Tracks (layer width: path | path; a pad name or v marks a point on that pad's centre or on a via)
1.2V  (via drill 0.25)
  Top 0.229: U$2.H8 9.64,23.65 10.6,24.61 U$2.G9 | U$2.H8 U$2.J9 | U$2.J9 U$2.K8 9.1,21.15 9.1,14.95 9.6,14.45 10.6,14.45 11.45,13.6 U$4.2 11.4,11.2 C8.1 12.55,9.75 C27.1 | U$2.J9 U$2.K10 | U$2.H8 v9.1,24.15 U$2.G7
  Bottom 0.229: C26.1 C24.1 3.9,23.1 C25.1 8.9,24.35 v9.1,24.15
3.3V  (via drill 0.25)
  Top 0.127: U$2.B9 v10.2,30.05 | U$2.B13 14.9,29.95 v15.1,29.95 | v13,27.15 13,27.05 U$2.E11 | U$2.E15 16.8,26.65 v17.1,26.95 | U$2.J15 16.4,22.65 v16.1,22.95 | U$2.R8 9.6,16.45 v9.9,16.15
  Top 0.152: U$2.H12 v13.1,23.15 | U$2.L12 v13.1,21.15 | U$2.M9 11.1,19.15 v11.1,18.25
  Top 0.229: U$7.3 25.64,19.31 26,18.95 C1.1 28.85,17.7 C2.1 v28.6,16.35 | L3V3.A 28.95,10.15 v28.2,10.15 | U$2.M6 U$2.N6 | U$2.N6 U$2.P5 U$2.P4 U$2.R4 U$2.T3 4.6,13.22 U$6.1 | U$2.D2 3.1,28.15 v3,28.15 | U$2.M2 3.1,20.15 v3.1,20.35 | U$2.N6 v7.2,19.05 | U$2.B5 6.1,29.15 v6,29.15 | U$7.7 U$7.8 22.71,25.95 C5.1 | C6.1 C5.1 | C5.1 C4.1 21.9,24.2 C3.1 | C3.1 21.65,22.7 C17.1 C15.1 | C12.1 22,18.35 C16.1 22,18.55 v22.7,18.55 | C12.1 C14.1 | C12.1 22.25,16.85 C13.1 v23.5,15.95 | C3.1 22,22.85 v22.7,22.85 | 9.6,12.45 U$4.3 | U$6.1 5.47,12.35 6.6,12.35 | U$6.1 4.97,11.56 | 4.97,11.56 U$6.4 | 4.97,11.56 4.98,11.55 | 6.6,12.35 C7.1 9.6,12.35 9.6,12.45 | U$2.J5 7.1,23.15 v7.1,25.15 U$2.F5 | U$2.E8 v9.1,26.15 | U$2.H2 v3.1,24.15 | C11.1 C9.1 26.15,31.4 C10.1 28,31.65 | 28,31.65 JP1.6 | U$2.N15 v16.1,18.15 | U$2.R12 v14,16.25 | 9.6,12.45 v9.6,12.85 | 28,31.65 v28,30.85 | 6.6,12.35 v6.6,12.05
  Bottom 0.127: v15.1,29.95 16.2,29.95 16.6,29.55 16.6,29.15 17,28.75 IC1.14 17.1,28.43 v17.1,26.95 | IC1.9 v13,27.15 | IC1.49 10.6,16.85 v9.9,16.15
  Bottom 0.152: IC1.49 10.6,17.75 v11.1,18.25
  Bottom 0.229: C22.1 3.65,28.7 3.65,28.14 | 3.65,28.14 C21.1 C23.1 | 3.65,28.14 3.64,28.15 v3,28.15 | C19.1 3.9,18.2 C18.1 C20.1 3.65,19.7 3.1,20.25 v3.1,20.35 | 6.08,29.15 v6,29.15 6.6,28.55 IC1.1 6.6,29.05 6.9,29.35 7.9,29.35 8.2,29.05 IC1.3 | IC1.27 27.98,28.53 v28,28.55 | v14,16.25 15.1,16.25 15.4,16.55 IC1.43
  Bottom 0.508: U$1.A7 9.5,8.15 v10.5,9.15
  pour Route15 (isolate 0.127): 0.1,31.15 32.1,31.15 32,8.95 0,8.95
50MHZ  (via drill 0.25)
  Top 0.127: U$2.R7 8.1,16.15 v8.1,15.95 | U$6.3 2.93,10.75 v3.5,10.75
  Bottom 0.127: v8.1,15.95 8,15.85 7,15.85 6.4,16.45 5.8,16.45 5.4,16.05 5.4,12.65 v3.5,10.75
A0  (via drill 0.25)
  Top 0.127: v11.7,15.05 11.6,15.05 11,15.65 11,15.85 10.6,16.25 10.4,16.25 10,16.65 10,16.85 9.6,17.25 U$2.P8
  Bottom 0.127: U$1.A15 19.5,7.35 11.8,15.05
  Bottom 0.152: 11.8,15.05 v11.7,15.05
A1  (via drill 0.25)
  Top 0.127: U$2.R9 10.8,16.65 v11.3,16.15
  Bottom 0.127: U$1.A16 20.5,7.25 19.1,8.65 18.8,8.65 v11.3,16.15
A2  (via drill 0.25)
  Top 0.127: U$2.P16 18.5,16.75 v18.5,15.75
  Bottom 0.127: v18.5,15.75 21.5,12.75 U$1.A17
A3  (via drill 0.25)
  Top 0.127: U$2.P13 15.1,17.15 15.1,15.55 22.2,8.45 v22.4,8.45
  Bottom 0.127: v22.4,8.45 22.5,8.35 U$1.A18
B0
  Top 0.127: U$1.B15 19.5,6.75 12.8,13.45 12.8,15.45 U$2.T11
B1
  Top 0.127: U$1.B16 20.5,6.15 13.1,13.55 13.1,16.15 U$2.R11
B2
  Top 0.127: U$1.B17 21.5,8.15 14.2,15.45 14.2,15.85 14.6,16.25 U$2.R13
B3
  Top 0.127: U$2.T13 22.5,7.75 U$1.B18
C0  (via drill 0.25)
  Top 0.127: U$2.T4 5.6,15.45 v6,15.05
  Bottom 0.127: U$1.A10 12.5,8.55 v6,15.05
C1  (via drill 0.25)
  Top 0.127: U$2.R5 6.6,16.55 6.1,16.05 v6.1,15.95
  Bottom 0.127: U$1.A11 13.5,8.15 6.7,14.95 6.7,15.65 6.4,15.95 v6.1,15.95
C2  (via drill 0.25)
  Top 0.127: U$2.T5 7.2,15.05 v7.3,15.05
  Bottom 0.127: U$1.A12 16.5,8.35 11,13.85 8.5,13.85 v7.3,15.05
C3  (via drill 0.25)
  Top 0.127: U$2.T6 7.6,15.45 v8,15.05
  Bottom 0.127: U$1.A13 17.5,7.75 11.1,14.15 8.9,14.15 v8,15.05
CS  (via drill 0.25)
  Top 0.127: U$7.1 23.09,20.14 22.4,19.45 v19.2,19.45 | U$2.T2 3.8,15.65 v4.1,15.35
  Top 0.229: U$7.1 23.09,22.14 25,24.05 25,26.85 25.6,27.45 27.9,27.45 28.8,28.35 28.8,29.91 JP1.5
  Bottom 0.127: v19.2,19.45 17,19.45 16.8,19.65 8.6,19.65 7.5,18.55 6.4,18.55 5,17.15 5,16.25 v4.1,15.35
D0  (via drill 0.25)
  Top 0.127: U$1.B10 12.5,6.35 11.5,7.35 v10.8,7.35 | v3,17.25 3,17.95 3.2,18.15 3.9,18.15 4.1,18.35 4.1,18.85 4.4,19.15 4.8,19.15 5.1,19.45 5.1,19.85 5.4,20.15 7.8,20.15 8.1,19.85 8.1,19.15 U$2.N7
  Route15 0.152: v3,17.25 8.2,12.05 8.2,8.85 9.7,7.35 v10.8,7.35
D1
  Top 0.127: U$1.B11 13.5,11.55 11.9,13.15 11.9,13.65 10.5,15.05 10.2,15.05 U$2.T8
D2
  Top 0.127: U$1.B12 16.5,8.95 12.2,13.25 12.2,13.85
  Top 0.152: 12.2,13.85 10.6,15.45 U$2.T9
D3
  Top 0.127: U$1.B13 17.5,8.35 12.5,13.35 12.5,14.85 11.7,15.65 U$2.T10
DONE
  Top 0.127: LDONE.A 18.65,13.6 U$2.T15
G0  (via drill 0.25)
  Top 0.127: U$1.B6 v8.5,7.25 | v6.4,13.15 7.2,13.15 8.6,14.55 U$2.T7
  Bottom 0.127: v8.5,7.25 8.5,8.15 8.1,8.55 8.1,11.45 v6.4,13.15
GND  (via drill 0.25)
  Top 0.127: U$2.B11 12.9,29.95 v13.1,29.95 | U$2.C14 15.6,28.85 v15.1,29.35 | U$2.A16 v18,31.05 | v9.1,29.35 8.9,29.35 U$2.B7 | C14.2 17.95,15.3 U$2.T16 17.1,16.15 v17.1,16.25 | U$2.R16 17.5,16.65 v17.1,16.25 | U$2.E12 14,26.65 14.5,27.15 14.7,27.15 15,26.85 15.2,26.85 15.5,27.15 15.9,27.15 v16.1,27.35 | U$2.G15 16.8,24.65 v17.1,24.95 | U$2.P14 16,17.65 16.5,17.15 16.7,17.15 17.1,16.75 v17.1,16.25 | U$2.L15 v16.2,20.25 | C16.2 20.7,18.45 v20.9,18.25
  Top 0.229: U$2.B11 12.64,29.61 | U$2.M5 U$2.N4 U$2.P3 U$2.R2 v3,16.05 U$2.T1 2.43,15.48 U$6.2 | U$2.E5 U$2.F6 8.1,25.15 v9.1,25.15 U$2.G8 | U$2.E5 U$2.D5 6.1,28.15 v5.1,28.15 U$2.C3 | C6.2 C5.2 | C5.2 C4.2 20.1,24.2 C3.2 20.35,22.7 C17.2 | C17.2 C15.2 | U$7.4 28.77,20.33 C1.2 | C1.2 30.15,17.7 C2.2 | C1.2 v30.9,18.95 | R18.1 30.45,10.05 v31.3,10.05 | R19.1 30.45,13.55 v31.3,13.55 | U$2.K2 3.2,22.05 v3,22.05 | v26.4,30.65 C10.2 25.15,29.85 C9.2 C11.2 23.35,30.05 v22.5,30.05 | C5.2 v19.6,25.95 | C14.2 C12.2 22.25,15.05 C13.2 v23.5,14.25 | C17.2 v19.6,21.45 | U$2.G10 v11.1,24.15 U$2.H9 | U$2.J8 v9.1,22.15 U$2.K7 | U$2.K9 v11.1,21.15 12.1,21.15 U$2.L11 U$2.M12 | U$2.R10 v12,16.25 | U$2.R6 7.3,16.35 v7.1,16.35 | U$2.E5 6.1,26.15 4.2,26.15 3.7,25.65 U$2.F2 | v6.7,10.45 7.9,10.45 C7.2 8.6,11.25 U$4.1 9.6,11.2 C8.2 v8.8,9.75 | U$2.A1 2.4,30.65 v2.1,30.35 | U$1.B14 v18.5,6.25 | U$1.B9 v11.5,6.15 | C27.2 12.6,11.55 v12.3,11.85
  Top 0.508: U$1.A3 v5.5,9.05 | U$1.A4 v6.5,9.05
  Route2 0.229: v18.5,6.25 18.5,8.95 | v11.5,6.15 11.5,8.95
  Bottom 0.127: IC1.6 10.6,28.95 10.2,29.35 v9.1,29.35 | IC1.41 17,16.35 v17.1,16.25 | v15.1,29.35 15.4,29.05 IC1.12 15.4,28.05 v16.1,27.35
  Bottom 0.229: 2.35,22.05 C26.2 C20.2 C18.2 2.35,16.9 C19.2 2.7,16.05 v3,16.05 | 2.35,22.05 C24.2 2.35,24.1 C25.2 2.1,25.7 C23.2 2.35,26.65 | 2.35,26.65 C21.2 2.35,28.7 C22.2 v2.1,30.35 | v3,22.05 2.35,22.05 | IC1.28 27.9,16.67 v27.9,16.45 | v12,16.25 12.7,16.25 13,16.55 IC1.46 | IC1.54 6.6,16.85 v7.1,16.35 7.8,16.35 8.2,16.75 IC1.52 | v18.5,6.25 U$1.B14 | v11.5,6.15 U$1.B9 | 2.35,26.65 v1.72,26.65
  Bottom 0.508: U$1.A4 v6.5,9.05 | U$1.A3 v5.5,9.05
  pour Route2 (isolate 0.127): 0,8.95 32,8.95 32,45.45 0,45.45
GRST  (via drill 0.25)
  Top 0.127: U$2.A2 3.6,30.75 3.2,31.15 1.8,31.15 1,30.35 1,11.85 v0.7,11.55 | v7.4,8.85 7.4,3.8 U$1.B5
  Bottom 0.127: v7.4,8.85 6.5,9.75 5.5,9.75 4.2,8.45 3.7,8.45 2.7,9.45 1.5,9.45 0.7,10.25 v0.7,11.55
HSYNC
  Top 0.229: R2.2 23.65,33.15 22.7,33.15 22.3,32.75 21.4,32.75 21,32.35 20.1,32.35 19.7,31.95 18.9,31.95 18.5,31.55 17.6,31.55 17.2,31.15 16.3,31.15 15.8,30.65 U$2.A14
MA0  (via drill 0.25)
  Top 0.127: U$2.F16 17.7,25.65 v18.1,26.05
  Bottom 0.127: IC1.23 24.2,28.05 23,26.85 18.9,26.85 v18.1,26.05
MA1  (via drill 0.25)
  Top 0.127: U$2.G14 v16.1,25.15
  Bottom 0.127: IC1.24 25,27.85 23.7,26.55 19.3,26.55 18.2,25.45 16.4,25.45 v16.1,25.15
MA2  (via drill 0.25)
  Top 0.127: U$2.G16 18,24.65 v18.4,25.05
  Bottom 0.127: IC1.25 25.8,28.05 24,26.25 20.7,26.25 19.5,25.05 v18.4,25.05
MA3  (via drill 0.25)
  Top 0.127: U$2.H15 16.7,23.65 v17.1,24.05
  Bottom 0.127: IC1.26 26.6,28.35 24.2,25.95 20.9,25.95 19.5,24.55 17.6,24.55 v17.1,24.05
MA4  (via drill 0.25)
  Top 0.152: v18.3,23.65 U$2.H16
  Bottom 0.152: IC1.29 26.6,18.25 21.2,23.65 v18.3,23.65
MA5  (via drill 0.25)
  Top 0.152: v16.1,24.15 U$2.H14
  Bottom 0.152: IC1.30 25.8,18.15 20.8,23.15 17.1,23.15 v16.1,24.15
MA6  (via drill 0.25)
  Top 0.152: v18.3,22.65 U$2.J16
  Bottom 0.152: IC1.31 25,18.25 20.6,22.65 v18.3,22.65
MA7  (via drill 0.25)
  Top 0.152: v19.4,22.05 18,22.05 U$2.K16
  Bottom 0.152: IC1.32 24.2,18.35 20.5,22.05 v19.4,22.05
MA8  (via drill 0.25)
  Top 0.152: v16.1,22.15 U$2.J14
  Bottom 0.152: IC1.33 23.4,18.55 21,20.95 19.1,20.95 17.9,22.15 v16.1,22.15
MA9  (via drill 0.25)
  Top 0.152: v17.1,21.15 U$2.K15
  Bottom 0.152: IC1.34 22.6,17.95 20,20.55 17.7,20.55 v17.1,21.15
MA10  (via drill 0.25)
  Top 0.127: U$2.F15 16.7,25.65 v17.1,26.05
  Bottom 0.127: IC1.22 23.4,28.15 22.4,27.15 18.5,27.15 17.5,26.15 17.2,26.15 v17.1,26.05
MA11  (via drill 0.25)
  Top 0.152: v16.1,21.15 U$2.K14
  Bottom 0.152: IC1.35 21.8,18.05 19.7,20.15 17.1,20.15 v16.1,21.15
MA12  (via drill 0.25)
  Top 0.127: U$2.R15 16.3,16.35 v16.3,16.15
  Bottom 0.127: 20.2,15.75 19.5,15.75 19,16.25 17.8,16.25 17.3,15.75 16.5,15.75 16.3,15.95 v16.3,16.15
  Bottom 0.152: IC1.36 21,16.55 20.2,15.75
MBA0  (via drill 0.25)
  Top 0.127: U$2.E16 18.3,26.65 20.5,28.85 20.9,28.85 v21.4,29.35
  Bottom 0.127: IC1.20 21.8,28.95 v21.4,29.35
MBA1  (via drill 0.25)
  Top 0.127: U$2.F14 15.6,25.75 v16.1,26.25
  Bottom 0.127: IC1.21 22.6,27.95 22.1,27.45 18.4,27.45 17.42,26.47 16.32,26.47 v16.1,26.25 16.2,26.35
MCAS  (via drill 0.25)
  Top 0.127: U$2.D16 17.8,27.65 v19.5,29.35
  Bottom 0.127: IC1.17 19.4,29.25 v19.5,29.35
MCKE  (via drill 0.25)
  Top 0.152: v19.6,16.35 18.8,17.15 18.8,17.45 U$2.N16
  Bottom 0.152: IC1.37 20.2,16.95 v19.6,16.35
MCLK  (via drill 0.25)
  Top 0.152: v16.2,19.15 16.1,19.15 U$2.M14
  Bottom 0.152: IC1.38 19.4,18.55 18.8,19.15 v16.2,19.15
MCS  (via drill 0.25)
  Top 0.127: U$2.B15 16.9,29.35 v17.1,29.35
  Bottom 0.127: v17.1,29.35 18.1,30.35 19.8,30.35 21,29.15 IC1.19
MDQ0  (via drill 0.25)
  Top 0.127: U$2.D7 8.4,27.65 v8.1,27.35
  Bottom 0.127: IC1.2 7.4,28.05 v8.1,27.35
MDQ1  (via drill 0.25)
  Top 0.127: U$2.E7 9.1,27.15 v9.1,27.25
  Bottom 0.127: IC1.4 9.1,28.43 v9.1,27.25
MDQ2  (via drill 0.25)
  Top 0.127: U$2.D8 9.8,27.65 v10.1,27.35
  Bottom 0.127: v10.1,27.35 9.8,27.65 IC1.5
MDQ3  (via drill 0.25)
  Top 0.127: U$2.D9 10.8,27.65 v11.1,27.35
  Bottom 0.127: v11.1,27.35 11.1,28.23 IC1.7
MDQ4  (via drill 0.25)
  Top 0.127: U$2.D11 12.4,27.65 v12.1,27.35
  Bottom 0.127: v12.1,27.35 12.1,28.43 IC1.8
MDQ5  (via drill 0.25)
  Top 0.127: U$2.D13 14.4,27.65 v14.1,27.35
  Bottom 0.127: IC1.10 13.8,27.65 v14.1,27.35
MDQ6  (via drill 0.25)
  Top 0.127: v15.1,27.35 15.1,28.15 U$2.C13
  Bottom 0.127: IC1.11 14.6,27.85 v15.1,27.35
MDQ7  (via drill 0.25)
  Top 0.127: U$2.B14 15.8,29.65 v16.1,29.35
  Bottom 0.127: IC1.13 16.2,29.25 v16.1,29.35
MDQ8  (via drill 0.25)
  Top 0.127: U$2.N14 v15.2,18.25
  Bottom 0.127: IC1.42 16.2,17.45 15.4,18.25 v15.2,18.25
MDQ9  (via drill 0.25)
  Top 0.127: U$2.N13 14.6,18.45 v14.3,18.15
  Bottom 0.127: IC1.44 14.6,17.85 v14.3,18.15
MDQ10  (via drill 0.25)
  Top 0.127: U$2.N12 13.6,18.45 v13.3,18.15
  Bottom 0.127: IC1.45 13.8,17.65 v13.3,18.15
MDQ11  (via drill 0.25)
  Top 0.152: U$2.N11 12.4,18.65 v12.1,18.95
  Bottom 0.152: IC1.47 12.2,17.75 12.4,17.95 12.4,18.65 v12.1,18.95
MDQ12  (via drill 0.25)
  Top 0.152: U$2.N10 11.6,18.45 v11.9,18.15
  Bottom 0.152: IC1.48 11.4,17.65 v11.9,18.15
MDQ13  (via drill 0.25)
  Top 0.152: U$2.P9 10.5,17.65 v10.1,18.05
  Bottom 0.152: IC1.50 9.8,17.75 v10.1,18.05
MDQ14  (via drill 0.25)
  Top 0.127: U$2.N8 9.8,18.65 v10.1,18.95
  Bottom 0.127: IC1.51 9,17.85 v10.1,18.95
MDQ15  (via drill 0.25)
  Top 0.127: U$2.P6 7.6,17.75 v8.1,18.25
  Bottom 0.127: IC1.53 7.4,17.85 7.8,18.25 v8.1,18.25
MDQMH  (via drill 0.25)
  Top 0.152: v15.1,19.15 U$2.M13
  Bottom 0.152: IC1.39 18.6,18.35 18.3,18.65 15.6,18.65 v15.1,19.15
MDQML  (via drill 0.25)
  Top 0.127: U$2.C16 18.1,29.15 v18.1,29.35
  Bottom 0.127: IC1.15 18.1,28.83 v18.1,29.35
MISO  (via drill 0.25)
  Top 0.127: U$2.T14 18.6,12.65 v25.6,12.65 | v25.6,14.15 25.6,17.95 24.36,19.18 U$7.2
  Top 0.229: U$7.2 24.36,21.61 25.5,22.75 26.7,22.75 v27.8,23.85
  Bottom 0.127: v25.6,12.65 v25.6,14.15
  Bottom 0.229: v27.8,23.85 27.82,23.85 JP1.3
MNC  (via drill 0.25)
  Top 0.127: U$2.P15 16.8,17.65 v17.3,18.15
  Bottom 0.127: IC1.40 17.8,17.65 v17.3,18.15
MOSI  (via drill 0.25)
  Top 0.127: U$2.P10 12,17.65 12.5,18.15 12.7,18.15 13,18.45 13,18.65 13.5,19.15 13.8,19.15 14.1,19.45 14.1,19.85 14.4,20.15 14.9,20.15 15.1,20.35 15.1,22.85 15.4,23.15 15.7,23.15 16,23.45 16.2,23.45 16.5,23.15 18.6,23.15 19,23.55 v19,24.11 | v26.4,24.15 26.91,24.65 U$7.5
  Top 0.229: U$7.5 28.48,23.99 JP1.2
  Bottom 0.127: v19,24.11 26.36,24.11 v26.4,24.15
MRAS  (via drill 0.25)
  Top 0.127: v20.2,29.35 18.1,27.25 17.4,27.25 17.2,27.45 17,27.45 16.8,27.25 16.6,27.25 16.1,26.75 15.7,26.75 U$2.E14
  Bottom 0.127: IC1.18 v20.2,29.35
MWE  (via drill 0.25)
  Top 0.127: U$2.D15 16.6,27.75 17.1,28.25 17.8,28.25 v18.9,29.35
  Bottom 0.127: IC1.16 18.6,29.05 v18.9,29.35
N$1
  Top 0.229: R1.1 26,36.85 25,37.85 25,39.25 21.8,42.45 20.07,42.45 X2.14
N$2
  Top 0.229: R2.1 24.5,38.55 23,40.05 19.4,40.05 18.6,40.85 18.6,42.05 16.66,43.99 X2.13
N$3
  Top 0.229: LDONE.C R19.2
N$4
  Top 0.127: U$2.T12 13.6,14.65 INIT_B.P
N$5
  Top 0.229: R15.2 R12.2 R9.2 R6.2 R3.2 17,38.15 X2.3
N$6
  Top 0.229: L3V3.C R18.2
N$7
  Top 0.229: R4.2 R7.2 R10.2 R13.2 | R13.2 R16.2 | R13.2 13.96,35.74 X2.2
N$8
  Top 0.229: R5.2 R8.2 R11.2 R14.2 R17.2 8,36.15 10.76,38.91 X2.1
SCK  (via drill 0.25)
  Top 0.127: v25,14.05 25,17.85 23.8,19.05 23.8,21.95 25.64,23.79 U$7.6 | U$2.R14 15.6,16.25 16,15.85 16,15.65 18.5,13.15 v25,13.15
  Top 0.229: U$7.6 25.64,26.29 26.4,27.05 28.48,27.05 JP1.4
  Bottom 0.127: v25,13.15 v25,14.05
TCK  (via drill 0.25)
  Top 0.127: U$1.B2 4.5,6.05 v4.8,6.35
  Top 0.152: U$2.A15 16.8,30.65 v17.1,30.35
  Route15 0.127: v4.8,6.35 5.1,6.65
  Route15 0.152: 5.1,6.65 5.1,8.15 4,9.25 4,11.05 2.4,12.65 1.9,12.65 1.2,13.35 1.2,27.45 4.9,31.15 16.3,31.15 v17.1,30.35
TDI
  Top 0.127: U$2.B1 1.3,28.35 1.3,12.05 1.6,11.75 3.3,11.75 4,11.05 4,10.55 3.5,10.05 U$1.B1 3.6,3.8
TDO  (via drill 0.25)
  Top 0.152: U$2.B16 17.8,29.85 18.1,29.85 19.1,30.85 v19.5,30.85
  Route15 0.152: v4,7.15 4,8.35 2.6,9.75 2.6,10.45 0.6,12.45 0.6,30.35 1.8,31.55 18.8,31.55 v19.5,30.85
  Bottom 0.127: U$1.A1 3.5,6.65 v4,7.15
TMS  (via drill 0.25)
  Top 0.152: U$2.B2 v3.1,30.15
  Route15 0.152: v4.6,6.95 4.6,8.15 2.9,9.85 2.9,10.55 0.9,12.55 0.9,27.95 v3.1,30.15
  Bottom 0.127: U$1.A2 4.5,5.85 4.3,6.05 4.3,6.65 v4.6,6.95
VB0
  Top 0.229: U$2.A9 10.6,31.15 11.4,31.95 12.3,31.95 12.7,32.35 13.5,32.35 13.9,32.75 14.9,32.75 15.3,33.15 16.15,33.15 R3.1
VB1
  Top 0.229: R6.1 18.5,33.95 17.7,33.15 16.8,33.15 16.4,32.75 15.5,32.75 15.1,32.35 14.1,32.35 13.7,31.95 12.84,31.95 12.44,31.55 11.6,31.55 11.1,31.05 11.1,29.41 10.84,29.15 10.1,29.15 U$2.C8
VB2
  Top 0.229: U$2.A10 12.1,31.15 12.6,31.15 13,31.55 13.9,31.55 14.3,31.95 15.3,31.95 15.7,32.35 16.6,32.35 17,32.75 17.9,32.75 18.3,33.15 19.15,33.15 R9.1
VB3
  Top 0.229: R12.1 20.65,33.15 19.7,33.15 19.3,32.75 18.5,32.75 18.1,32.35 17.2,32.35 16.8,31.95 15.9,31.95 15.5,31.55 14.5,31.55 U$2.A12
VB4
  Top 0.229: U$2.A13 15.1,31.15 15.7,31.15 16.1,31.55 17,31.55 17.4,31.95 18.3,31.95 18.7,32.35 19.5,32.35 19.9,32.75 20.8,32.75 21.2,33.15 22.15,33.15 R15.1
VG0
  Top 0.229: U$2.C6 7.1,29.15 7.1,31.95 8.3,33.15 8.8,33.15 9.5,33.85 R4.1
VG1
  Top 0.229: 11,33.85 R7.1 10.15,33.15 9.4,33.15 9,32.75 8.5,32.75 7.6,31.85 U$2.A6
VG2
  Top 0.229: U$2.B6 8.1,30.15 8.1,31.75 8.7,32.35 9.2,32.35 9.6,32.75 10.4,32.75 10.8,33.15 11.7,33.15 12.5,33.95 R10.1
VG3
  Top 0.229: U$2.A8 9.6,31.95 10,32.35 10.6,32.35 11,32.75 11.9,32.75 12.3,33.15 13.15,33.15 R13.1
VG4
  Top 0.127: 10.1,31.85 10.1,30.55 9.6,30.05
  Top 0.229: 10.1,31.85 10.7,31.85 11.2,32.35 12.1,32.35 12.5,32.75 13.3,32.75 13.7,33.15 14.65,33.15 R16.1 | U$2.B8 9.6,30.05
VR0
  Top 0.229: U$2.B3 4.1,30.15 4.1,31.5 2,33.6 R5.1
VR1
  Top 0.229: U$2.A3 4.6,31.95 3.5,33.05 R8.1
VR2
  Top 0.229: U$2.A4 5.6,33 5,33.6 R11.1
VR3
  Top 0.229: R14.1 6.5,33.6 6.1,33.2 6.1,30.45 5.6,29.95 U$2.B4
VR4
  Top 0.229: 8,33.85 R17.1 8,33.45 6.6,32.05 U$2.A5
VSYNC
  Top 0.127: 13.7,29.15 14.1,29.55 14.1,29.85 14.5,30.25 14.8,30.25 15,30.45 15.2,30.45 15.4,30.25 16.6,30.25 17,29.85 17.2,29.85 17.5,30.15 17.9,30.15 19.3,31.55
  Top 0.229: U$2.C9 10.9,28.65 11.4,29.15 13.7,29.15 | 19.3,31.55 19.9,31.55 20.3,31.95 21.2,31.95 21.6,32.35 22.5,32.35 22.9,32.75 23.8,32.75 24.2,33.15 25.15,33.15 R1.2

### Text on the board
tPlace: 3.3V | CS | SCK | MISO | MOSI | GND | DONE | VGA Card v0.1 / MB v1.0 / 10-21-2013 | PWR